# Altium schematic sheet Signal_Protection.SchDoc
size A4
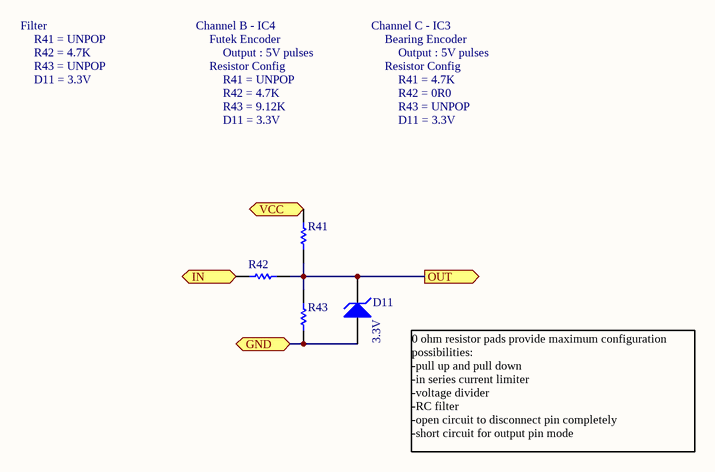
[diagram p0: Signal_Protection.SchDoc]

## Parts
D11  Voltage - Reverse Standoff (Typ): 3.3V  [DS-SOD523]  (hidden comment: DS - TVS ESD5Z3.3T1G)
R41  RS - RESISTOR  [RS-0603]  (value not drawn)
R42  RS - RESISTOR  [RS-0603]  (value not drawn)
R43  RS - RESISTOR  [RS-0603]  (value not drawn)

## Ports
GND, IN (in), OUT (out), VCC

## Nets
GND: D11.A R43.1 ; port GND
IN: R42.2 ; port IN
OUT: D11.K R41.2 R42.1 R43.2 ; port OUT
VCC: R41.1 ; port VCC

## Notes on the sheet
- Filter
- R41 = UNPOP
- R42 = 4.7K
- R43 = UNPOP
- D11 = 3.3V
- Channel B - IC4
- Futek Encoder
- Resistor Config
- Output : 5V pulses
- Channel C - IC3
- Bearing Encoder
- R41 = 4.7K
- R43 = 9.12K
- R42 = 0R0
- 0 ohm resistor pads provide maximum configuration possibilities:
  -pull up and pull down
  -in series current limiter
  -voltage divider
  -RC filter
  -open circuit to disconnect pin completely
  -short circuit for output pin mode

## Library data of the parts
D11 = DS - TVS ESD5Z3.3T1G: TVS 3.3V; Manufacturer: ON Semiconductor; FORWARS VOLTAGE: *; (FIELD A): *; (FIELD B): *; Supplier 1: Digi-Key; Supplier Part Number 1: ESD5Z3.3T1GOSCT-ND
R41-R43 = RS - RESISTOR: TOLERANCE: RES TOL; POWER: RES POWER; Supplier Part Number 1: *; Supplier 1: *; (FIELD A): *; (FLIED C): *; (FIELD B): *; Manufacturer: *